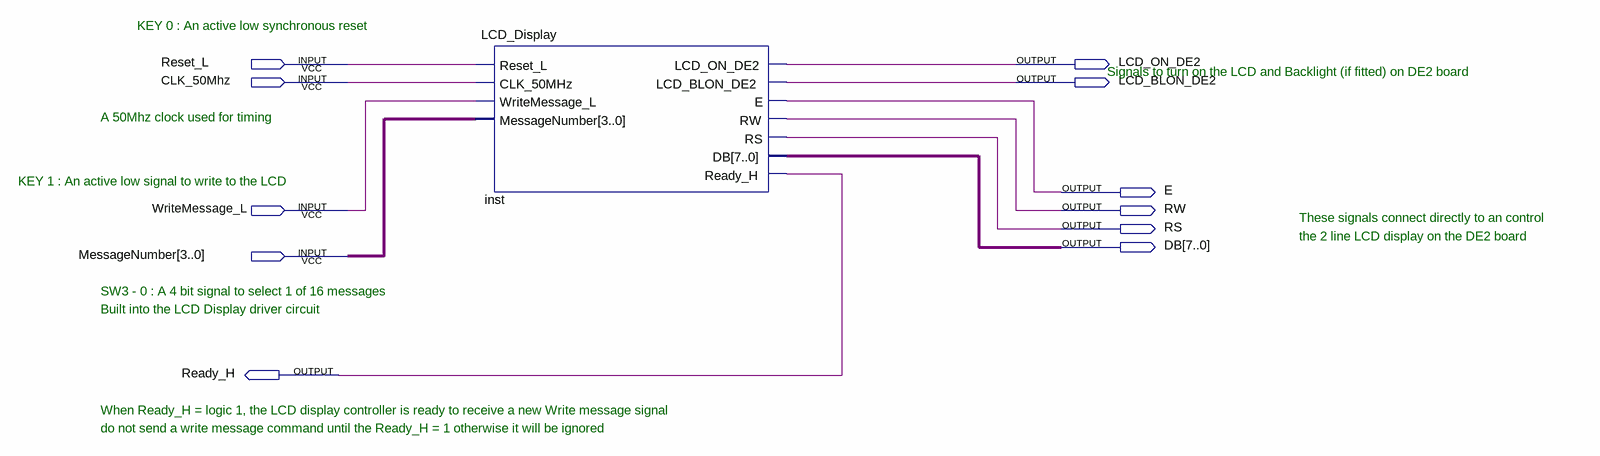
[diagram p0: schematic sheet]
// Quartus schematic LCD_Display_Controller.bdf as structural Verilog: 1 symbols, 11 pins
module LCD_Display_Controller (
  input  Reset_L,
  input  CLK_50Mhz,
  input  WriteMessage_L,
  input  [3:0] MessageNumber,
  output LCD_ON_DE2,
  output LCD_BLON_DE2,
  output E,
  output RW,
  output RS,
  output [7:0] DB,
  output Ready_H
);

  LCD_Display inst (
    .Reset_L(Reset_L), .CLK_50MHz(CLK_50Mhz), .WriteMessage_L(WriteMessage_L), .MessageNumber(MessageNumber),
    .LCD_ON_DE2(LCD_ON_DE2), .LCD_BLON_DE2(LCD_BLON_DE2), .E(E), .RW(RW), .RS(RS), .DB(DB), .Ready_H(Ready_H));

  // Notes on the sheet:
  //   KEY 0 : An active low synchronous reset
  //   Signals to turn on the LCD and Backlight (if fitted) on DE2 board
  //   A 50Mhz clock used for timing
  //   KEY 1 : An active low signal to write to the LCD
  //   These signals connect directly to an control
  //   the 2 line LCD display on the DE2 board
  //   SW3 - 0 : A 4 bit signal to select 1 of 16 messages
  //   Built into the LCD Display driver circuit
  //   When Ready_H = logic 1, the LCD display controller is ready to receive a new Write message signal
  //   do not send a write message command until the Ready_H = 1 otherwise it will be ignored
endmodule
